# EAGLE design Universal_2022_06 (EAGLE 9.6.2)
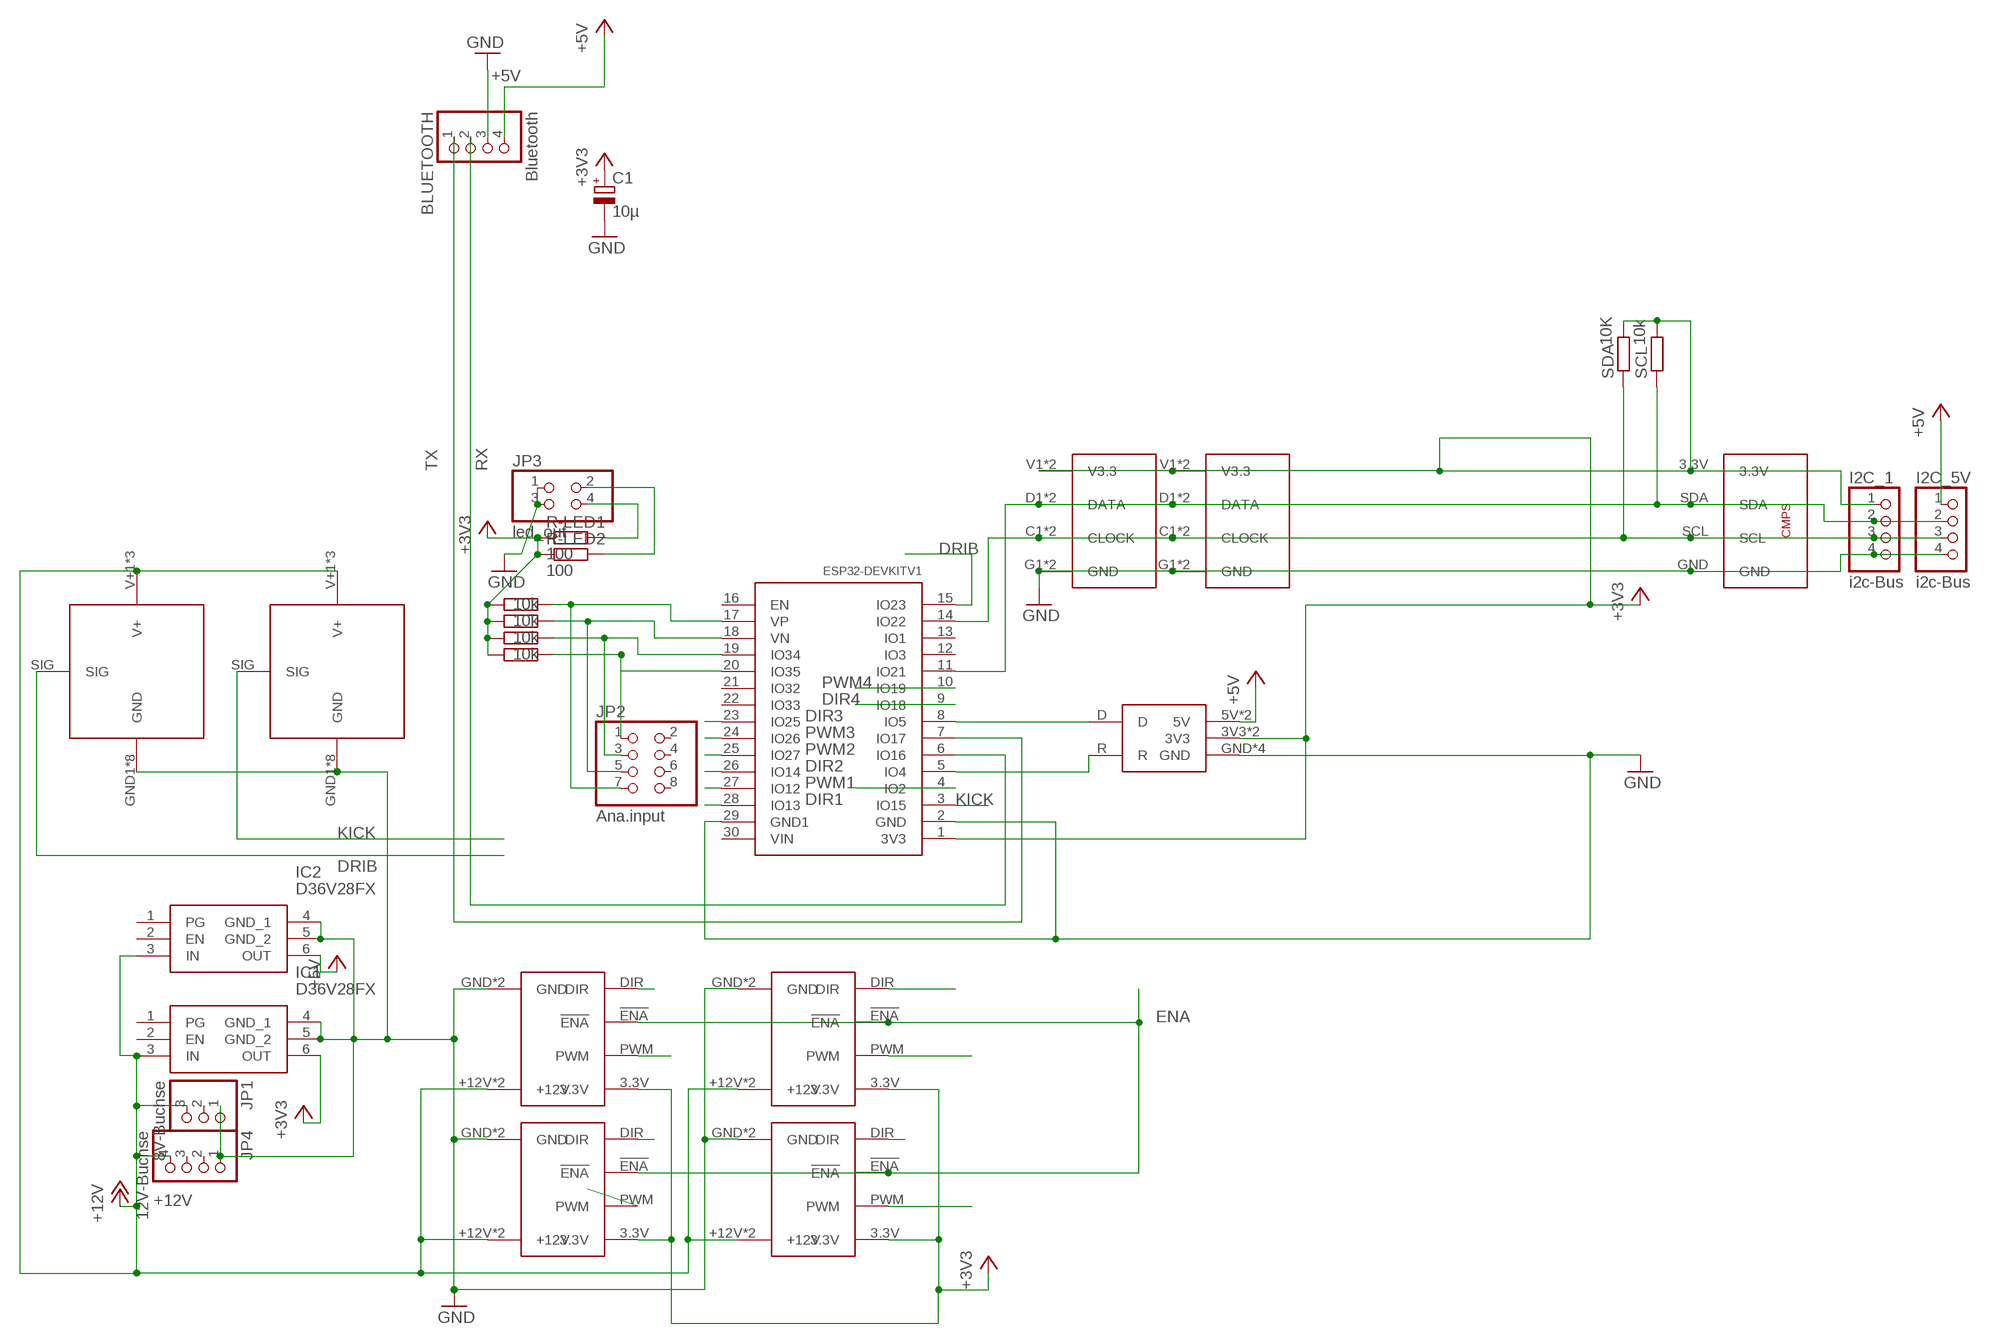
[diagram p0: schematic, sheet 1]

## Parts
BLUETOOTH  Bluetooth  PINHD-1X4/90  [1X04/90]
C1  10µ  CPOL-EUE2,5-6E  [E2,5-6E]
I2C_1  i2c-Bus  PINHD-1X4  [1X04]
I2C_5V  i2c-Bus  PINHD-1X4  [1X04]
IC1  D36V28FX  [D36V28FX]
IC2  D36V28FX  [D36V28FX]
JP1  8V-Buchse  PINHD-1X3  [1X03]
JP2  Ana.input  PINHD-2X4  [2X04]
JP3  led_out  PINHD-2X2  [2X02]
JP4  12V-Buchse  PINHD-1X4  [1X04]
R-LED1  100  R-EU_0207/10  [0207/10]
R-LED2  100  R-EU_0207/10  [0207/10]
R_AD14  10k  R-EU_0207/10  [0207/10]
R_AD25  10k  R-EU_0207/10  [0207/10]
R_AD26  10k  R-EU_0207/10  [0207/10]
R_AD27  10k  R-EU_0207/10  [0207/10]
SCL  10k  R-EU_0207/10  [0207/10]
SDA  10K  R-EU_0207/10  [0207/10]
U$1  TASTER_LED  [TASTER_LED]
U$3  TASTER_LED  [TASTER_LED]
U$5  CANBUS  [CANBUS]
U$7  KICKER  [KICKER]
U$8  CMPS  [CMPS]
U$11  IFX9201BREAKOUT  [IFX9201BREAKOUT]
U$13  ESP32DEVKITV1  [ESP32-DEVKITV1]
U$14  IFX9201BREAKOUT  [IFX9201BREAKOUT]
U$15  IFX9201BREAKOUT  [IFX9201BREAKOUT]
U$16  IFX9201BREAKOUT  [IFX9201BREAKOUT]
U$17  KICKER  [KICKER]

## Nets
+3V3: C1.+ I2C_1.1 IC1.6(OUT) R-LED1.1 R-LED2.1 R_AD14.1 R_AD25.1 R_AD26.1 R_AD27.1 SCL.2 SDA.2 U$1.V1(V3.3) U$1.V2(V3.3) U$3.V1(V3.3) U$3.V2(V3.3) U$5.3V3 U$5.3V3_1(3V3) U$8.3.3V U$11.3.3V U$13.1(3V3) U$14.3.3V U$15.3.3V U$16.3.3V
+5V: BLUETOOTH.4 I2C_5V.1 IC2.6(OUT) U$5.5V U$5.5V_1(5V)
+12V: IC1.3(IN) IC2.3(IN) JP1.3 JP4.4 U$7.V+1(V+) U$7.V+2(V+) U$7.V+3(V+) U$11.+12V U$11.+12V2(+12V) U$14.+12V U$14.+12V2(+12V) U$15.+12V U$15.+12V2(+12V) U$16.+12V U$16.+12V2(+12V) U$17.V+1(V+) U$17.V+2(V+) U$17.V+3(V+)
CLOCK: I2C_1.3 I2C_5V.3 SDA.1 U$1.C1(CLOCK) U$1.C2(CLOCK) U$3.C1(CLOCK) U$3.C2(CLOCK) U$8.SCL U$13.14(IO22)
D: U$5.D U$13.8(IO5)
DATA: I2C_1.2 I2C_5V.2 SCL.1 U$1.D1(DATA) U$1.D2(DATA) U$3.D1(DATA) U$3.D2(DATA) U$8.SDA U$13.11(IO21)
DIR1: U$13.28(IO13) U$16.DIR
DIR2: U$13.26(IO14) U$15.DIR
DIR3: U$11.DIR U$13.23(IO25)
DIR4: U$13.9(IO18) U$14.DIR
DRIB: U$7.SIG U$13.15(IO23)
ENA: U$11.!ENA U$13.4(IO2) U$14.!ENA U$15.!ENA U$16.!ENA
GND: BLUETOOTH.3 C1.- I2C_1.4 I2C_5V.4 IC1.4(GND_1) IC1.5(GND_2) IC2.4(GND_1) IC2.5(GND_2) JP1.1 JP3.1 JP3.3 JP4.1 U$1.G1(GND) U$1.G2(GND) U$3.G1(GND) U$3.G2(GND) U$5.GND U$5.GND_1(GND) U$5.GND_2(GND) U$5.GND_3(GND) U$7.GND1(GND) U$7.GND2(GND) U$7.GND3(GND) U$7.GND4(GND) U$7.GND5(GND) U$7.GND6(GND) U$7.GND7(GND) U$7.GND8(GND) U$8.GND U$11.GND U$11.GND2(GND) U$13.2(GND) U$13.29(GND1) U$14.GND U$14.GND2(GND) U$15.GND U$15.GND2(GND) U$16.GND U$16.GND2(GND) U$17.GND1(GND) U$17.GND2(GND) U$17.GND3(GND) U$17.GND4(GND) U$17.GND5(GND) U$17.GND6(GND) U$17.GND7(GND) U$17.GND8(GND)
KICK: U$13.3(IO15) U$17.SIG
N$1: JP2.7 R_AD25.2 U$13.17(VP)
N$2: JP2.5 R_AD26.2 U$13.18(VN)
N$3: JP2.3 R_AD27.2 U$13.19(IO34)
N$4: JP2.1 R_AD14.2 U$13.20(IO35)
N$8: JP3.4 R-LED1.2
N$9: JP3.2 R-LED2.2
PWM1: U$13.27(IO12) U$16.PWM
PWM2: U$13.25(IO27) U$15.PWM
PWM3: U$11.PWM U$13.24(IO26)
PWM4: U$13.10(IO19) U$14.PWM
R: U$5.R U$13.5(IO4)
RX: BLUETOOTH.2 U$13.6(IO16)
TX: BLUETOOTH.1 U$13.7(IO17)
Unconnected: IC1.1(PG) IC1.2(EN) IC2.1(PG) IC2.2(EN) JP1.2 JP2.2 JP2.4 JP2.6 JP2.8 JP4.2 JP4.3 U$13.12(IO3) U$13.13(IO1) U$13.16(EN) U$13.21(IO32) U$13.22(IO33) U$13.30(VIN)

## Library data of the parts
BLUETOOTH I2C_1 I2C_5V JP4 = pinhead:PINHD-1X4: PIN HEADER
C1 = rcl:CPOL-EU: POLARIZED CAPACITOR, European symbol; SPICEPREFIX: C
IC1 IC2 = D36V28FX:D36V28FX: 5V, 3.2A Step-Down Voltage Regulator D36V28F5 Source: Datasheet <https://www.pololu.com/product/3782>; DESCRIPTION: 5V, 3.2A Step-Down Voltage Regulator D36V28F5; HEIGHT: 8.77mm; MANUFACTURER_NAME: POLOLU ROBOTICS & ELECTRONICS; MANUFACTURER_PART_NUMBER: D36V28FX
JP1 = pinhead:PINHD-1X3: PIN HEADER
JP2 = pinhead:PINHD-2X4: PIN HEADER
JP3 = pinhead:PINHD-2X2: PIN HEADER
R-LED1 R-LED2 R_AD14 R_AD25-R_AD27 SCL SDA = rcl:R-EU_: RESISTOR, European symbol; SPICEPREFIX: R
U$1 U$3 = Taster_LED:TASTER_LED: Taster / LED Board mit 2 Tastern und 2 LEDs Angeschlossen über i2c Port Expander PCF8574TS i2c Adresse zwingend per Lötbrücke zu setzen.
U$5 = canbus:CANBUS
U$7 U$17 = kicker:KICKER
U$8 = cmps:CMPS: CMPS cmps11, cmps12, cmps14 Kompass-Sensor
U$11 U$14-U$16 = ifx9201breakout:IFX9201BREAKOUT
U$13 = ESP32-DEVKITV1:ESP32DEVKITV1

## Board
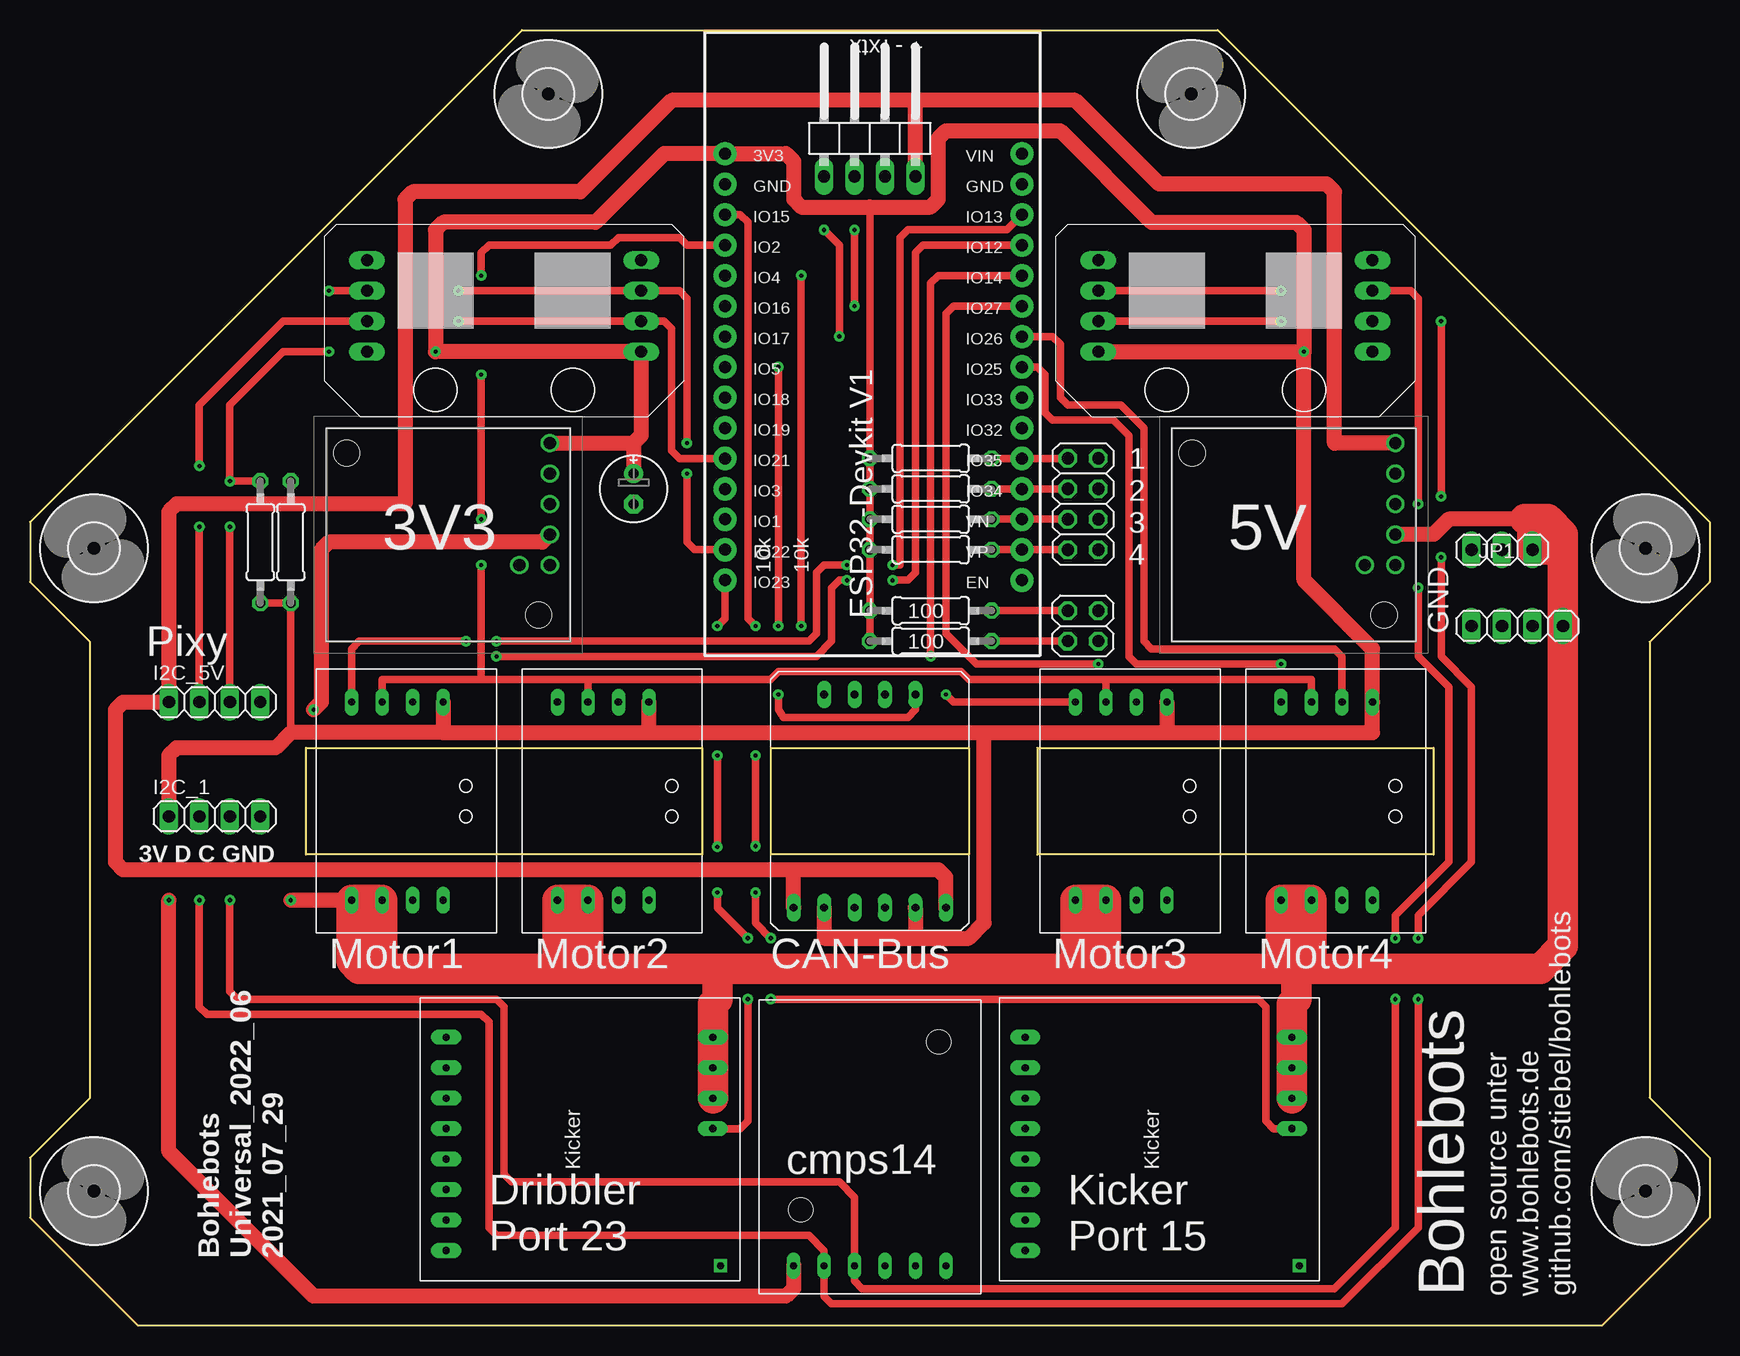
[diagram p1: board, top side]
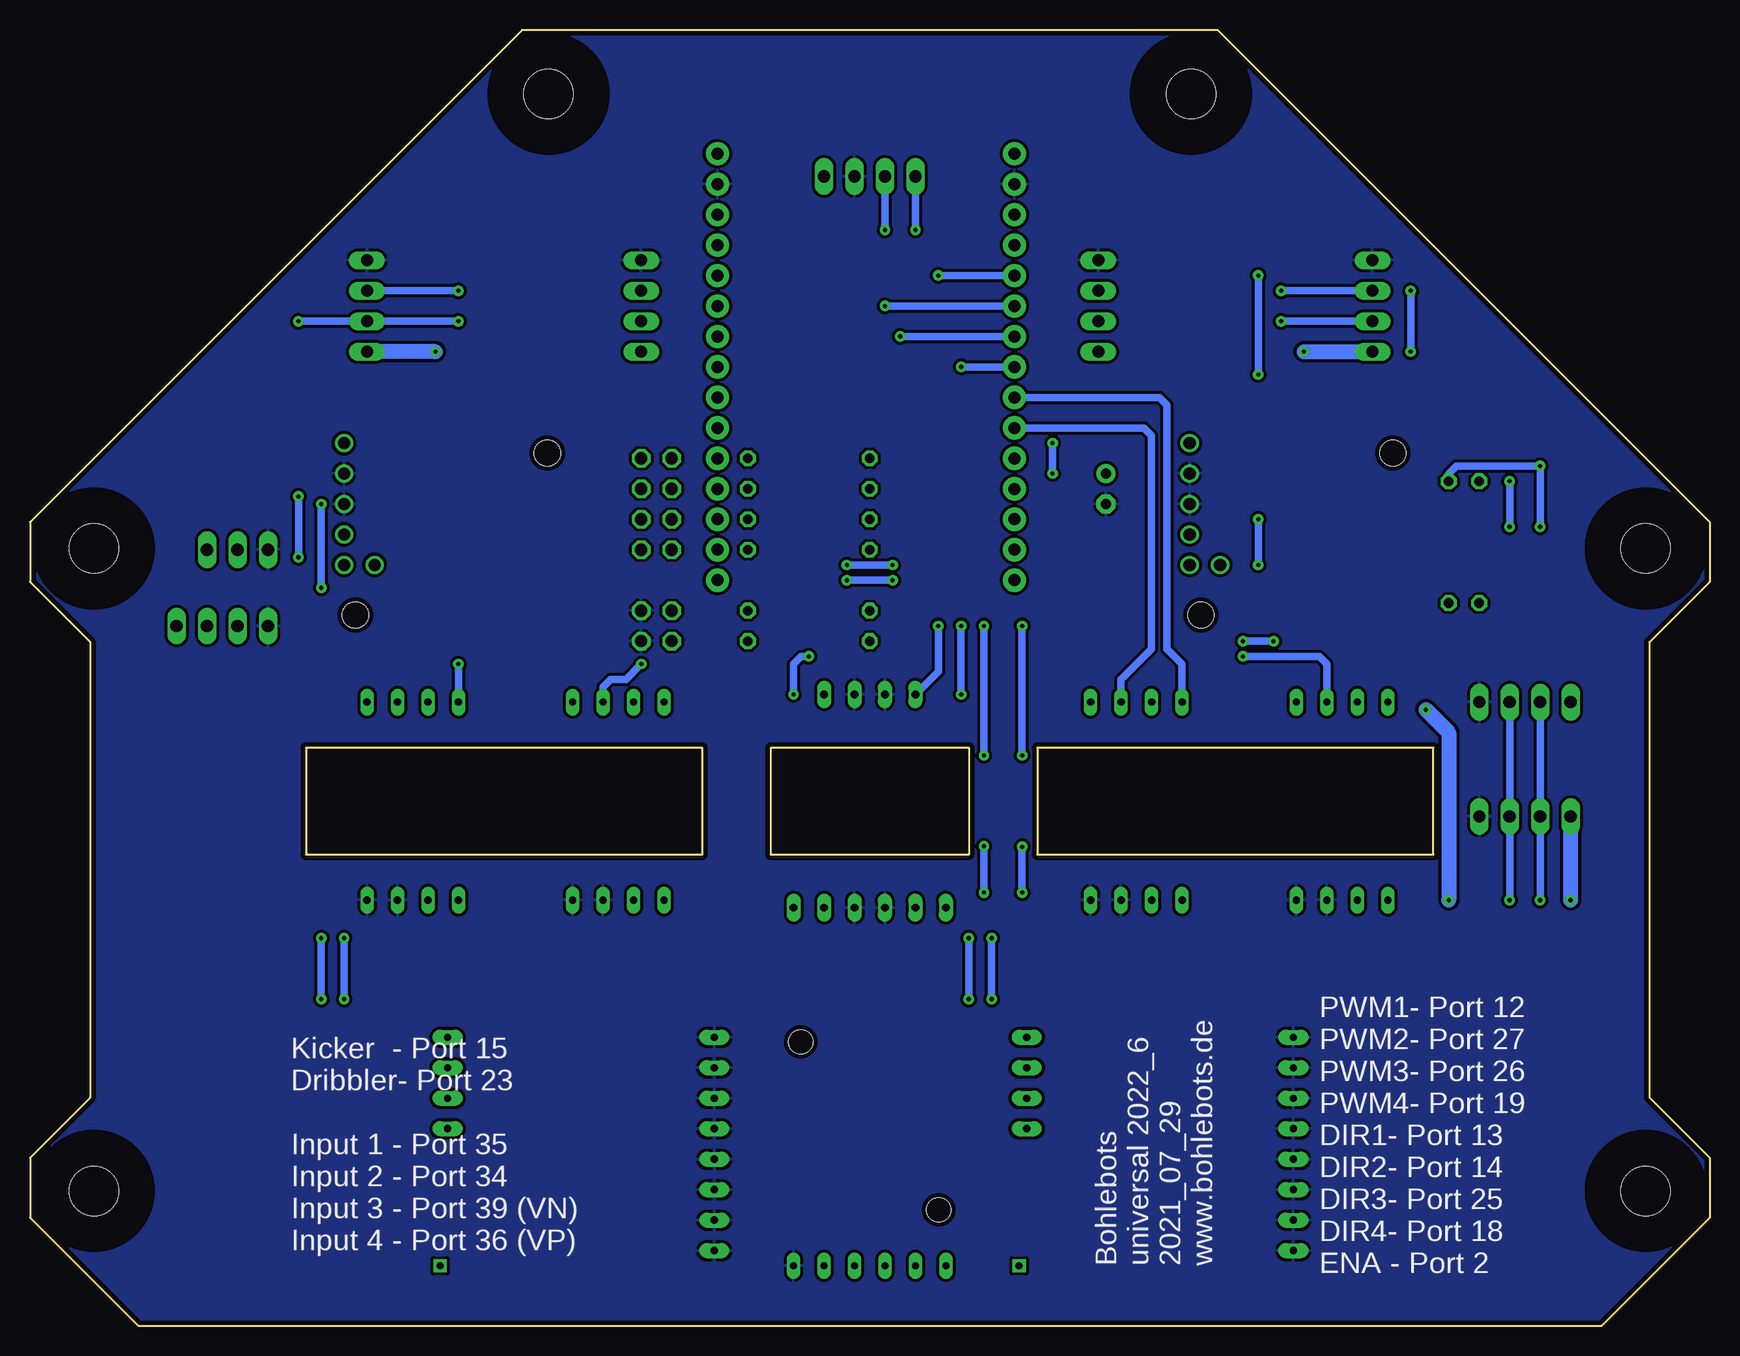
[diagram p2: board, bottom side, seen from below]

Size 140 x 108 mm. Coordinates in mm from the lower left corner, seen from the top.
Outline: 5,19 5,57 0,62 0,67 41,108 99,108 140,67 140,62 135,57 135,19 140,14 140,9 131,0 9,0 0,9 0,14 5,19
Outline: 23.01,48.16 56.03,48.16 56.03,39.27 23.01,39.27 23.01,48.16
Outline: 61.74,48.16 78.25,48.16 78.25,39.27 61.74,39.27 61.74,48.16
Outline: 83.97,48.16 116.99,48.16 116.99,39.27 83.97,39.27 83.97,48.16
Copper layers (1*16): Top 0.035mm / dielectric 1.5mm / Bottom 0.035mm
Design rules "default *": minimum track width 10mil, minimum drill 8mil, track to track 10mil, track to pad 10mil, pad to pad 10mil, via to via 10mil, smd to smd 10mil, copper to edge 15mil, drill to drill 8mil, minimum pad ring 10mil, minimum via ring 10mil, stop-mask expansion 0mil, vias tented up to drill 0mil, thermal gap 10mil

### Footprints (pad centres in the part's own frame; a part is rotated, then mirrored left to right if it is on the bottom)
1X04/90 = drill 1.016 long: 1 -3.81,-3.81; 2 -1.27,-3.81; 3 1.27,-3.81; 4 3.81,-3.81
E2,5-6E = drill 0.813 pad 1.575: + -1.27,0 | drill 0.813 pad 1.575 octagon: - 1.27,0
1X04 = drill 1.016 long: 1 -3.81,0; 2 -1.27,0; 3 1.27,0; 4 3.81,0
D36V28FX = drill 1.02 pad 1.53: 1 0,0; 2 0,-2.54; 3 2.54,-2.54; 4 5.08,-2.54; 5 7.62,-2.54; 6 10.16,-2.54 | hole 2.18: -4.17,-1.61; 9.33,14.39
1X03 = drill 1.016 long: 1 -2.54,0; 2 0,0; 3 2.54,0
2X04 = drill 1.016 octagon: 1 -3.81,-1.27; 2 -3.81,1.27; 3 -1.27,-1.27; 4 -1.27,1.27; 5 1.27,-1.27; 6 1.27,1.27; 7 3.81,-1.27; 8 3.81,1.27
2X02 = drill 1.016 octagon: 1 -1.27,-1.27; 2 -1.27,1.27; 3 1.27,-1.27; 4 1.27,1.27
0207/10 = drill 0.813 octagon: 1 -5.08,0; 2 5.08,0
TASTER_LED = drill 1 long: C1 -11.43,-4.445; C2 11.43,-4.445; D1 -11.43,-1.905; D2 11.43,-1.905; G1 -11.43,-6.985; G2 11.43,-6.985; V1 -11.43,0.635; V2 11.43,0.635
4,1 = hole 4.1: 0,0
CANBUS = drill 0.65 long: 3V3 8.89,3.81; 3V3_1 8.89,-3.81; 5V 8.89,6.35; 5V_1 8.89,-6.35; D -8.89,3.81; GND -8.89,1.27; GND_1 -8.89,-1.27; GND_2 8.89,1.27; GND_3 8.89,-1.27; R -8.89,-3.81
KICKER = drill 0.6 pad 1.27 long: GND1 2.54,24.511; GND2 5.08,24.511; GND3 7.62,24.511; GND4 10.16,24.511; GND5 12.7,24.511; GND6 15.24,24.511; GND7 17.78,24.511; GND8 20.32,24.511; SIG 12.7,2.286; V+1 15.24,2.286; V+2 17.78,2.286; V+3 20.32,2.286 | drill 0.6 square: NC 1.27,1.651
CMPS = drill 0.6 long: 3.3V -6.35,-10.16; GND 6.35,-10.16; MODE 1.27,-10.16; NN 3.81,-10.16; SCL -1.27,-10.16; SDA -3.81,-10.16 | hole 2: -5.75,-5.5; 5.75,8.5
IFX9201BREAKOUT = drill 0.6 long: 3.3V -3.81,-8.255; !ENA 1.27,-8.255; +12V 1.27,8.255; +12V2 3.81,8.255; DIR 3.81,-8.255; GND -3.81,8.255; GND2 -1.27,8.255; PWM -1.27,-8.255
ESP32-DEVKITV1 = drill 1 pad 1.93: 1 -22.87,-13.54; 2 -20.33,-13.54; 3 -17.79,-13.54; 4 -15.25,-13.54; 5 -12.71,-13.54; 6 -10.17,-13.54; 7 -7.63,-13.54; 8 -5.09,-13.54; 9 -2.55,-13.54; 10 -0.01,-13.54; 11 2.53,-13.54; 12 5.07,-13.54; 13 7.61,-13.54; 14 10.15,-13.54; 15 12.69,-13.54; 16 12.69,11.23; 17 10.15,11.23; 18 7.61,11.23; 19 5.07,11.23; 20 2.53,11.23; 21 -0.01,11.23; 22 -2.55,11.23; 23 -5.09,11.23; 24 -7.63,11.23; 25 -10.17,11.23; 26 -12.71,11.23; 27 -15.25,11.23; 28 -17.79,11.23; 29 -20.33,11.23; 30 -22.87,11.23

### Placement (x,y rotation side)
BLUETOOTH  70,99.59 0 top
C1  50.31,69.75 270 top
I2C_1  15.39,42.45 0 top
I2C_5V  15.39,51.97 0 top
IC1  40.79,63.4 90 top
IC2  111.28,63.4 90 top
JP1  122.7,64.67 0 top
JP2  87.78,68.48 270 top
JP3  87.78,58.32 90 top
JP4  123.97,58.32 0 top
R-LED1  75.08,59.59 0 top
R-LED2  75.08,57.05 0 top
R_AD14  75.08,72.29 0 top
R_AD25  75.08,64.67 0 top
R_AD26  75.08,67.21 0 top
R_AD27  75.08,69.75 0 top
SCL  21.74,65.31 270 top
SDA  19.2,65.31 270 top
U$1  39.52,81.81 180 top
U$2  [4,1]  5.33,64.79 67.5 top
U$3  100.48,81.81 180 top
U$4  [4,1]  96.79,102.67 67.5 top
U$5  70,43.72 270 top
U$6  [4,1]  134.67,11.21 67.5 top
U$7  59.2,3.71 90 top
U$8  70,15.14 0 top
U$9  [4,1]  43.21,102.67 22.5 top
U$10  [4,1]  134.67,64.79 22.5 top
U$11  108.1,43.72 180 top
U$12  [4,1]  5.33,11.21 22.5 top
U$13  71.47,74.82 270 top
U$14  47.77,43.72 180 top
U$15  90.95,43.72 180 top
U$16  30.63,43.72 180 top
U$17  107.47,3.71 90 top

### Tracks (layer width: path | path; a pad name or v marks a point on that pad's centre or on a via)
+3V3  (via drill 0.35)
  Top 0.61: SDA.2 SCL.2 21.74,49.43 | R-LED2.1 R-LED1.1 R_AD25.1 R_AD26.1 R_AD27.1 R_AD14.1 70,93.25
  Top 1.27: IC1.6 50.31,73.56 | 50.31,73.56 C1.+ | 50.31,73.56 50.95,74.19 U$1.V1 v33.8,81.18 33.8,91.34 34.44,91.97 47.14,91.97 52.86,97.69 U$13.1 63.02,97.69 63.65,97.06 63.65,93.88 64.28,93.25 70,93.25 75.08,93.25 75.72,93.88 75.72,98.96 76.35,99.59 85.88,99.59 93.5,91.97 105.56,91.97 106.19,91.34 v106.19,81.18 | U$3.V2 v106.19,81.18 | U$8.3.3V 63.65,3.08 63.02,2.44 23.65,2.44 11.58,14.5 v11.58,35.46 | U$16.3.3V 34.44,49.43 | 34.44,49.43 51.59,49.43 | 51.59,49.43 U$14.3.3V | U$15.3.3V 94.77,49.43 | 51.59,49.43 79.53,49.43 | 79.53,49.43 94.77,49.43 | 94.77,49.43 111.91,49.43 U$11.3.3V 111.91,56.41 106.19,62.13 v106.19,81.18 | U$5.3V3_1 66.19,32.28 73.81,32.28 | U$5.3V3 73.81,32.28 | 73.81,32.28 78.25,32.28 79.53,33.55 79.53,49.43 | I2C_1.1 11.58,47.52 12.22,48.16 20.47,48.16 21.74,49.43 34.44,49.43
  Bottom 1.27: v11.58,35.46 I2C_1.1 | v106.19,81.18 U$3.V1 | v33.8,81.18 U$1.V2
+5V
  Top 1.27: IC2.6 108.73,73.56 108.73,94.52 108.1,95.15 94.13,95.15 87.14,102.14 73.81,102.14 | BLUETOOTH.4 73.81,102.14 | 73.81,102.14 53.49,102.14 45.87,94.52 31.9,94.52 31.27,93.88 31.27,68.48 12.22,68.48 11.58,67.84 I2C_5V.1 7.77,51.97 7.13,51.34 7.13,38.63 7.77,38 63.65,38 | U$5.5V_1 63.65,38 | U$5.5V 76.35,37.37 75.72,38 63.65,38
+12V  (via drill 0.35)
  Top 1.27: 127.78,64.03 127.15,64.67 | 125.25,66.58 124.61,67.21 118.26,67.21 116.99,65.94 IC2.3 | 106.83,29.74 105.56,29.74 | 105.18,26.82 105.56,27.2 | 56.92,26.82 57.3,27.2 | IC1.3 42.7,65.31 24.91,65.31 24.28,64.67 24.28,51.97 v23.65,51.34 | v21.74,35.46 U$16.+12V2
  Top 2.54: 127.15,64.67 JP1.3 125.25,66.58 | U$17.V+1 U$17.V+2 U$17.V+3 105.18,26.82 | 104.29,29.74 105.56,29.74 105.56,27.2 | 104.29,29.74 89.69,29.74 | 89.69,29.74 87.14,29.74 | 87.14,29.74 57.3,29.74 | 57.3,29.74 46.5,29.74 | 46.5,29.74 43.97,29.74 | 43.97,29.74 29.36,29.74 | 29.36,29.74 27.45,29.74 26.82,30.38 U$16.+12V2 U$16.+12V 29.36,29.74 | 43.97,29.74 U$14.+12V2 U$14.+12V 46.5,29.74 | 87.14,29.74 U$15.+12V2 U$15.+12V 89.69,29.74 | 104.29,29.74 U$11.+12V2 U$11.+12V 106.83,29.74 125.88,29.74 127.78,31.65 JP4.4 127.78,64.03 127.78,65.94 126.52,67.21 124.61,67.21 | U$7.V+1 U$7.V+2 U$7.V+3 56.92,26.82 | 57.3,27.2 57.3,29.74
  Bottom 1.27: v23.65,51.34 21.74,49.43 v21.74,35.46
CLOCK  (via drill 0.35)
  Top 0.61: v16.66,35.46 16.66,27.84 17.3,27.2 38.89,27.2 39.52,26.57 39.52,12.6 40.16,11.96 67.46,11.96 68.73,10.7 U$8.SCL 68.73,3.71 69.36,3.08 108.73,3.08 113.81,8.16 v113.81,27.2 | I2C_5V.3 v16.66,66.58 | v24.91,81.18 21.1,81.18 16.66,76.73 v16.66,70.38 SDA.1 | v24.91,86.26 U$1.C2 | v54.76,73.56 54.76,85.62 54.12,86.26 U$1.C1 v35.71,86.26 | v54.76,71.02 54.76,65.31 55.39,64.67 U$13.14 | v113.81,32.28 113.81,34.19 118.26,38.63 118.26,53.24 115.72,55.78 v115.72,61.5 | v115.72,68.48 115.72,85.62 115.09,86.26 U$3.C1 | v104.29,86.26 U$3.C2
  Bottom 0.61: v16.66,35.46 I2C_1.3 I2C_5V.3 | v16.66,66.58 v16.66,70.38 | v24.91,81.18 v24.91,86.26 | v54.76,73.56 v54.76,71.02 | v113.81,27.2 v113.81,32.28 | v115.72,61.5 v115.72,68.48 | U$3.C1 v104.29,86.26 | v35.71,86.26 U$1.C2
D  (via drill 0.35)
  Top 0.61: U$5.D 73.81,51.34 73.17,50.7 62.8,50.7 62.38,51.34 v62.38,52.61 | v62.38,58.32 v62.38,79.91
  Bottom 0.61: v62.38,58.32 v62.38,52.61 | v62.38,79.91 U$13.8
DATA  (via drill 0.35)
  Top 0.61: v14.12,35.46 14.12,26.57 14.76,25.94 37.62,25.94 38.25,25.3 38.25,8.16 38.89,7.52 64.92,7.52 66.19,6.25 U$8.SDA 66.19,2.44 66.83,1.8 109.37,1.8 115.72,8.16 v115.72,27.2 | I2C_5V.2 v14.12,66.58 | v14.12,71.66 14.12,76.73 21.1,83.72 U$1.D2 | U$13.11 54.12,72.29 53.49,72.92 53.49,83.09 52.86,83.72 U$1.D1 v35.71,83.72 | v115.72,32.28 115.72,34.19 120.16,38.63 120.16,53.24 117.62,55.78 v117.62,64.03 | v117.62,69.11 v117.62,83.72 | v104.29,83.72 U$3.D2
  Bottom 0.61: v14.12,35.46 I2C_1.2 I2C_5V.2 | v14.12,66.58 v14.12,71.66 21.1,71.66 21.74,71.02 SCL.1 | v115.72,27.2 v115.72,32.28 | v117.62,64.03 v117.62,69.11 | v117.62,83.72 U$3.D1 v104.29,83.72 | v35.71,83.72 U$1.D2
DIR1  (via drill 0.35)
  Top 0.61: U$13.28 81.43,91.34 73.17,91.34 72.54,90.7 72.54,63.4 v71.91,63.4 | U$16.DIR 26.82,56.41 27.45,57.05 v36.34,57.05 | v68.09,63.4 66.19,63.4 65.56,62.77 65.56,57.69 64.92,57.05 v38.89,57.05
  Bottom 0.61: v36.34,57.05 v38.89,57.05 | v68.09,63.4 v71.91,63.4
DIR2  (via drill 0.35)
  Top 0.61: U$13.26 75.72,87.53 75.08,86.9 v75.08,55.78 | U$15.DIR 76.98,51.97 v76.35,52.61
  Bottom 0.61: v76.35,52.61 76.35,55.14 75.72,55.78 v75.08,55.78
DIR3  (via drill 0.35)
  Top 0.61: v104.29,55.14 92.22,55.14 91.59,55.78 91.59,74.19 90.32,75.47 85.24,75.47 84.61,76.1 84.61,79.28 83.97,79.91 U$13.23
  Bottom 0.61: U$11.DIR v104.29,55.14
DIR4
  Bottom 0.61: U$13.9 45.87,77.37 45.23,76.73 45.23,56.41 43.97,55.14 U$14.DIR
DRIB  (via drill 0.35)
  Top 0.61: U$7.SIG 59.2,16.41 59.84,17.05 v59.84,27.2 | U$13.15 57.93,58.95 v57.3,58.32 | v57.3,47.52 v57.3,39.91 | v57.3,36.09 57.3,34.83 v59.84,32.28
  Bottom 0.61: v59.84,27.2 v59.84,32.28 | v57.3,58.32 v57.3,47.52 | v57.3,39.91 v57.3,36.09
ENA  (via drill 0.35)
  Top 0.61: U$16.!ENA 29.36,53.88 37.62,53.88 | 37.62,53.88 46.5,53.88 | 46.5,53.88 61.74,53.88 62.38,54.51 77.62,54.51 78.25,53.88 89.69,53.88 | U$11.!ENA 106.83,53.88 89.69,53.88 | U$15.!ENA 89.69,53.88 | U$14.!ENA 46.5,53.88 | U$13.4 54.76,90.07 54.12,90.7 49.05,90.7 48.41,90.07 38.25,90.07 37.62,89.44 v37.62,87.53 | v37.62,79.28 v37.62,67.21 | v37.62,63.4 37.62,53.88
  Bottom 0.61: v37.62,87.53 v37.62,79.28 | v37.62,67.21 v37.62,63.4
GND
  pour Bottom: 40.33,109.77 99.67,109.77 141.77,67.67 141.77,9.33 130.67,-1.77 9.33,-1.77 -1.77,9.33 -1.77,67.67
KICK  (via drill 0.35)
  Top 0.61: U$17.SIG 103.66,16.41 103.02,17.05 103.02,26.57 102.38,27.2 v61.74,27.2 | U$13.3 59.2,92.61 59.84,91.97 59.84,58.95 v60.48,58.32 | v60.48,36.09 60.48,33.55 v61.74,32.28 | v60.48,47.52 v60.48,39.95
  Bottom 0.61: v61.74,27.2 v61.74,32.28 | v60.48,58.32 v60.48,47.52 | v60.48,39.95 v60.48,36.09
N$1
  Top 0.61: R_AD25.2 U$13.17 JP2.7
N$2
  Top 0.61: R_AD26.2 U$13.18 JP2.5
N$3
  Top 0.61: R_AD27.2 U$13.19 JP2.3
N$4
  Top 0.61: R_AD14.2 U$13.20 JP2.1
N$8
  Top 0.61: R-LED1.2 JP3.4
N$9
  Top 0.61: R-LED2.2 JP3.2
PWM1  (via drill 0.35)
  Top 0.61: U$13.27 74.44,90.07 73.81,89.44 73.81,62.77 73.17,62.13 v71.91,62.13 | v68.09,62.13 67.46,62.13 66.83,61.5 66.83,57.05 65.56,55.78 v38.89,55.78
  Bottom 0.61: U$16.PWM 31.9,55.14 32.53,55.78 v38.89,55.78 | v68.09,62.13 v71.91,62.13
PWM2  (via drill 0.35)
  Top 0.61: U$13.25 76.98,84.99 76.35,84.35 76.35,57.69 78.89,55.14 v89.05,55.14
  Bottom 0.61: U$15.PWM 92.22,53.24 91.59,53.88 90.32,53.88 v89.05,55.14
PWM3
  Top 0.61: U$11.PWM 109.37,55.78 108.73,56.41 93.5,56.41 92.86,57.05 92.86,74.83 90.95,76.73 86.51,76.73 85.88,77.37 85.88,81.81 85.24,82.45 U$13.24
PWM4
  Bottom 0.61: U$14.PWM 49.05,53.88 46.5,56.41 46.5,74.19 47.14,74.83 U$13.10
R  (via drill 0.35)
  Top 0.61: v64.28,58.32 v64.28,87.53
  Bottom 0.61: U$5.R 64.28,54.51 v64.28,58.32 | v64.28,87.53 U$13.5
RX  (via drill 0.35)
  Top 0.61: v68.73,84.99 v68.73,91.34
  Bottom 0.61: U$13.6 v68.73,84.99 | v68.73,91.34 BLUETOOTH.2
TX  (via drill 0.35)
  Top 0.61: v67.46,82.45 67.46,90.07 v66.19,91.34
  Bottom 0.61: U$13.7 v67.46,82.45 | v66.19,91.34 BLUETOOTH.1

### Text on the board
tPlace: + - rxtx | 3V D C GND
tNames: 3V3 | 5V | 10k | 10k | 1 / 2 / 3 / 4 | 100 | GND | Pixy | 100 | Motor1 | Motor2 | CAN-Bus | Motor3 | Motor4 | cmps14 | Bohlebots / Universal_2022_06 / 2021_07_29 | Dribbler / Port 23 | Kicker / Port 15 | Bohlebots | open source unter / www.bohlebots.de / github.com/stiebel/bohlebots
bNames: Kicker - Port 15 / Dribbler- Port 23 / / Input 1 - Port 35 / Input 2 - Port 34 / Input 3 - Port 39 (VN) / Input 4 - Port 36 (VP) | Bohlebots / universal 2022_6 / 2021_07_29 / www.bohlebots.de | PWM1- Port 12 / PWM2- Port 27 / PWM3- Port 26 / PWM4- Port 19 / DIR1- Port 13 / DIR2- Port 14 / DIR3- Port 25 / DIR4- Port 18 / ENA - Port 2